# Altium schematic sheet BarTable.schdoc
size 508 x 304 mm
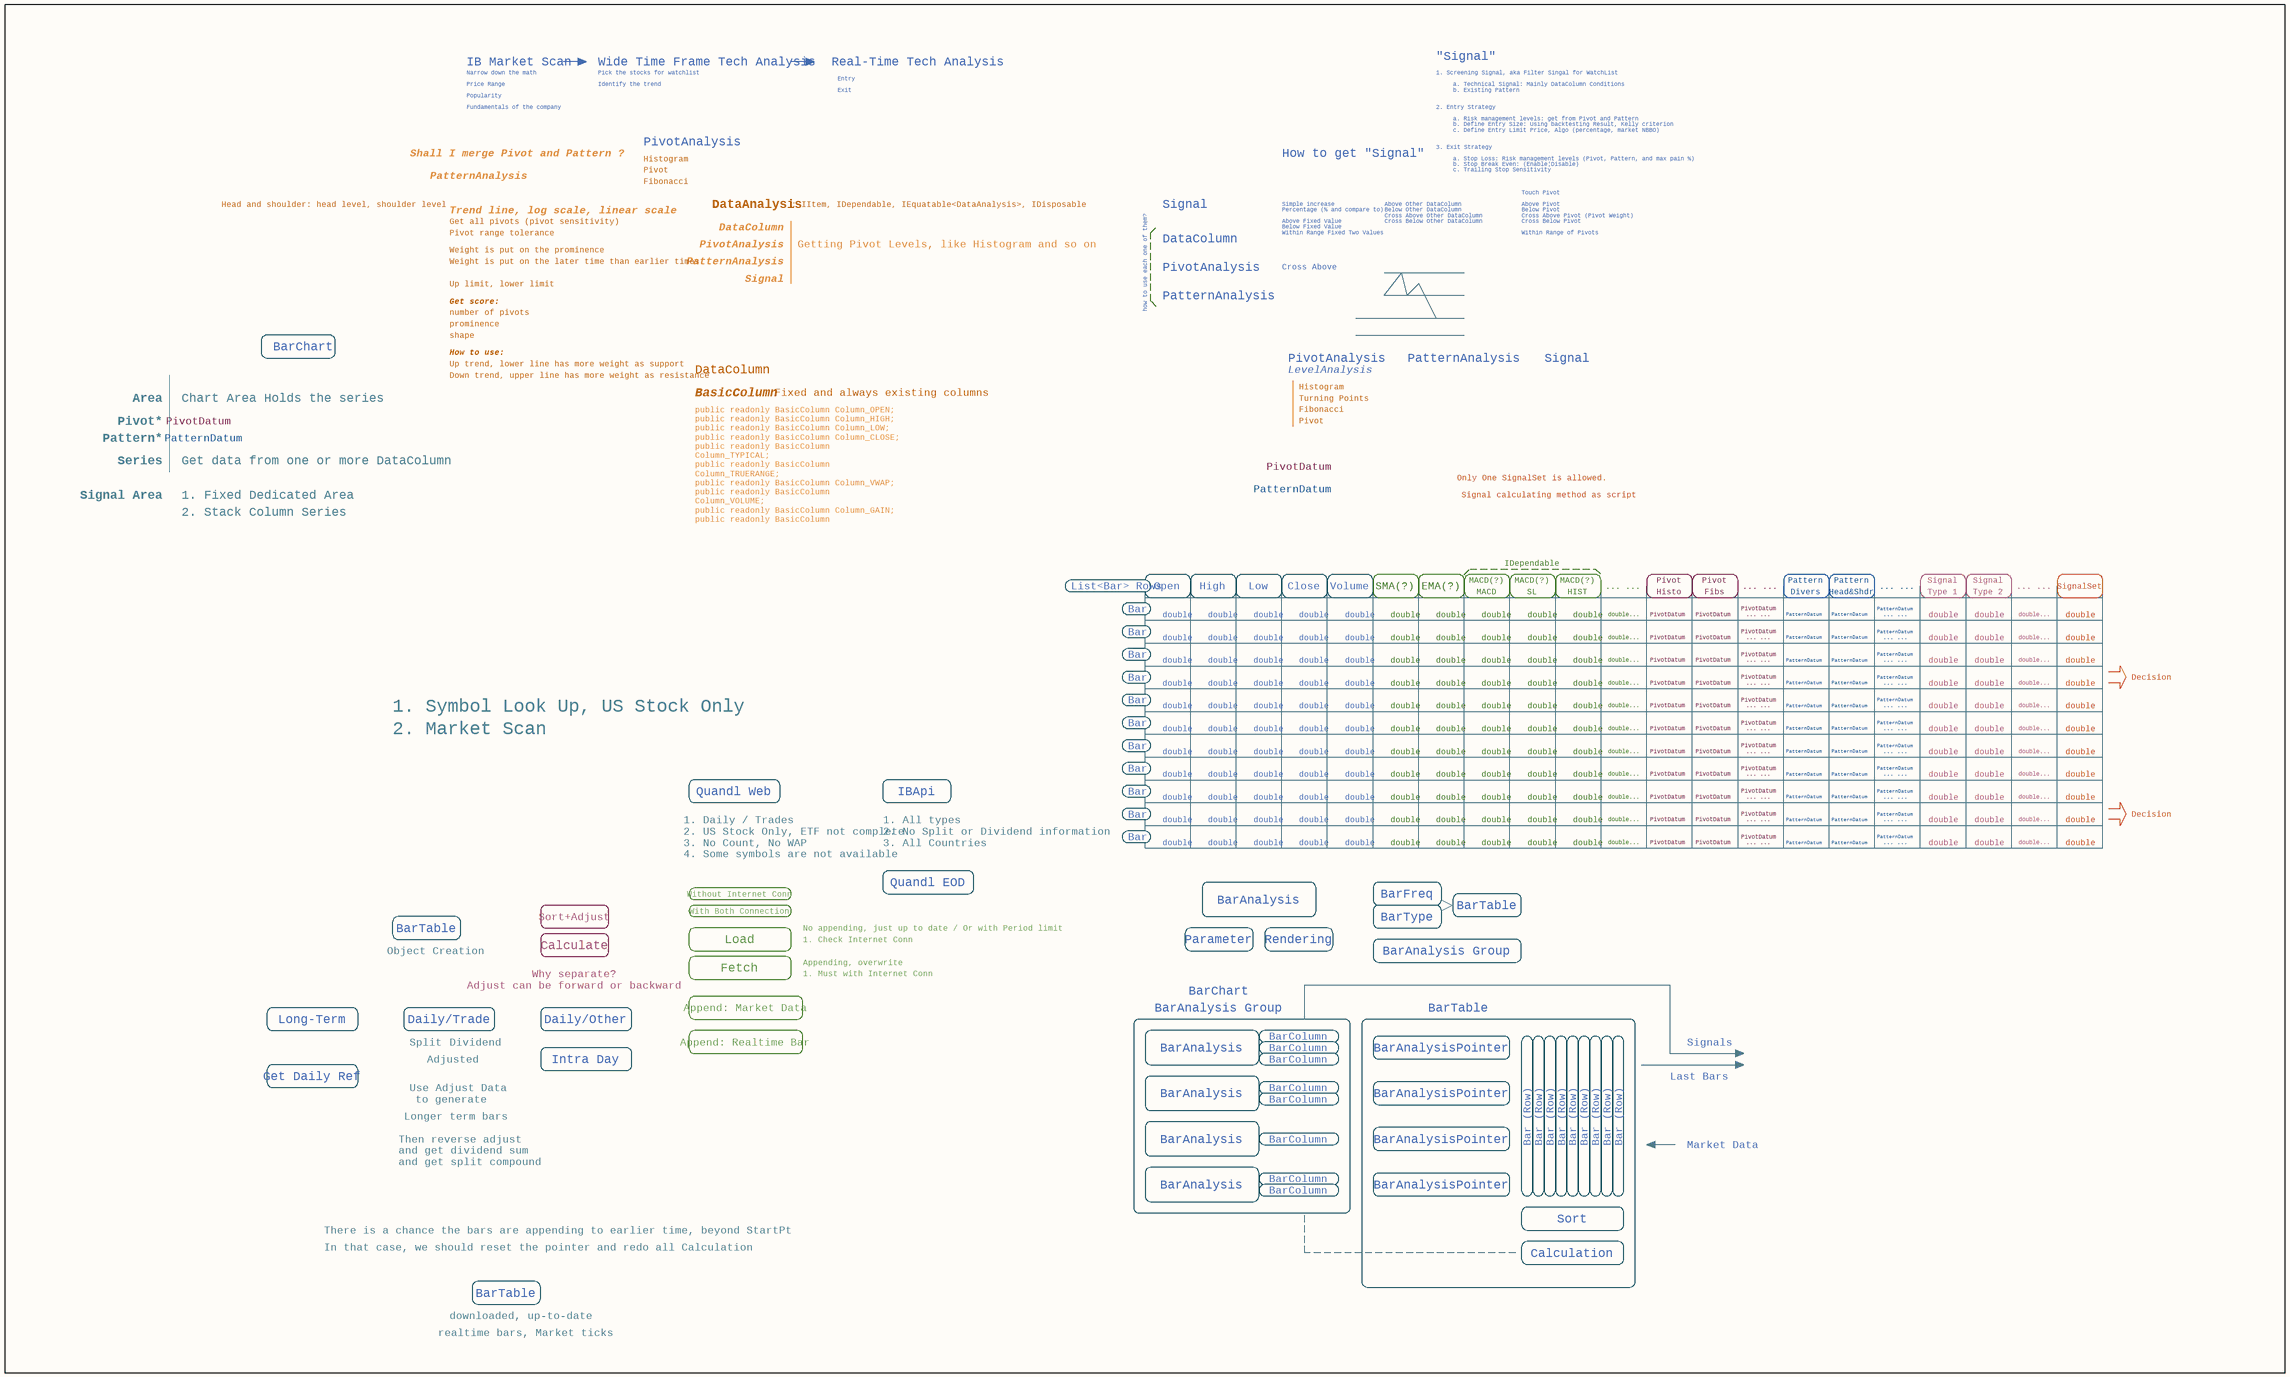
[diagram p0: BarTable.schdoc]

## Notes on the sheet
- IB Market Scan
- Narrow down the math
- Price Range
- Wide Time Frame Tech Analysis
- Pick the stocks for watchlist
- Identify the trend
- Real-Time Tech Analysis
- Entry
- "Signal"
- 1. Screening Signal, aka Filter Singal for WatchList
- a. Technical Signal: Mainly DataColumn Conditions
- Popularity
- Fundamentals of the company
- PivotAnalysis
- Exit
- 2. Entry Strategy
- 3. Exit Strategy
- b. Existing Pattern
- a. Risk management levels: get from Pivot and Pattern
- c. Define Entry Limit Price, Algo (percentage, market NBBO)
- b. Define Entry Size: Using backtesting Result, Kelly criterion
- PatternAnalysis
- Shall I merge Pivot and Pattern ?
- Pivot
- Histogram
- Fibonacci
- How to get "Signal"
- a. Stop Loss: Risk management levels (Pivot, Pattern, and max pain %)
- b. Stop Break Even: (Enable|Disable)
- c. Trailing Stop Sensitivity
- Touch Pivot
- Head and shoulder: head level, shoulder level
- Get all pivots (pivot sensitivity)
- Pivot range tolerance
- Weight is put on the later time than earlier times
- Trend line, log scale, linear scale
- Weight is put on the prominence
- DataAnalysis
- DataColumn
- : IItem, IDependable, IEquatable<DataAnalysis>, IDisposable
- Getting Pivot Levels, like Histogram and so on
- Signal
- Above Fixed Value
- Below Fixed Value
- Within Range Fixed Two Values
- Percentage (% and compare to)
- Simple increase
- Above Other DataColumn
- Below Other DataColumn
- Cross Above Other DataColumn
- Cross Below Other DataColumn
- Cross Above Pivot (Pivot Weight)
- Cross Below Pivot
- Above Pivot
- Below Pivot
- Within Range of Pivots
- Up limit, lower limit
- Get score:
- number of pivots
- how to use each one of them?
- Cross Above
- BarChart
- Up trend, lower line has more weight as support
- Down trend, upper line has more weight as resistance
- prominence
- shape
- How to use:
- LevelAnalysis
- Area
- Pivot*
- Chart Area Holds the series
- PivotDatum
- BasicColumn
- Fixed and always existing columns
- Turning Points
- Series
- Pattern*
- Get data from one or more DataColumn
- PatternDatum
- Only One SignalSet is allowed.
- Signal Area
- 1. Fixed Dedicated Area
- 2. Stack Column Series
- public readonly BasicColumn Column_OPEN;
  public readonly BasicColumn Column_HIGH;
  public readonly BasicColumn Column_LOW;
  public readonly BasicColumn Column_CLOSE;
  public readonly BasicColumn Column_TYPICAL;
  public readonly BasicColumn Column_TRUERANGE;
  public readonly BasicColumn Column_VWAP;
  public readonly BasicColumn Column_VOLUME;
  public readonly BasicColumn Column_GAIN;
  public readonly BasicColumn Column_PERCENT;
  public readonly BasicColumn Column_PIVOT;
  public readonly BasicColumn Column_DIVIDEND;
  public readonly BasicColumn Column_SPLIT;
- Signal calculating method as script
- List<Bar> Rows
- Open
- High
- Low
- Close
- Volume
- SMA(?)
- EMA(?)
- MACD(?)
- MACD
- IDependable
- SL
- HIST
- ... ...
- Histo
- Fibs
- Pattern
- Divers
- Head&Shdr
- Type 1
- Type 2
- SignalSet
- Bar
- double
- double...
- 1. Symbol Look Up, US Stock Only
- Decision
- 2. Market Scan
- 1. Daily / Trades
- 2. US Stock Only, ETF not complete
- Quandl Web
- 1. All types
- 2. No Split or Dividend information
- IBApi
- 3. No Count, No WAP
- 4. Some symbols are not available
- 3. All Countries
- Quandl EOD
- BarTable
- Sort+Adjust
- Calculate
- Without Internet Conn
- With Both Connection
- Load
- No appending, just up to date / Or with Period limit
- 1. Check Internet Conn
- Parameter
- BarAnalysis
- Rendering
- BarFreq
- BarType
- Object Creation
- Why separate?
- Adjust can be forward or backward
- Fetch
- Appending, overwrite
- 1. Must with Internet Conn
- BarAnalysis Group
- Long-Term
- Split
- Adjusted
- Daily/Trade
- Dividend
- Intra Day
- Daily/Other
- Append: Market Data
- Append: Realtime Bar
- BarColumn
- BarAnalysisPointer
- Signals
- Get Daily Ref
- Use Adjust Data
- to generate
- Last Bars
- Then reverse adjust
- and get dividend sum
- and get split compound
- Longer term bars
- Bar (Row)
- Market Data
- Sort
- There is a chance the bars are appending to earlier time, beyond StartPt
- In that case, we should reset the pointer and redo all Calculation
- Calculation
- realtime bars, Market ticks
- downloaded, up-to-date